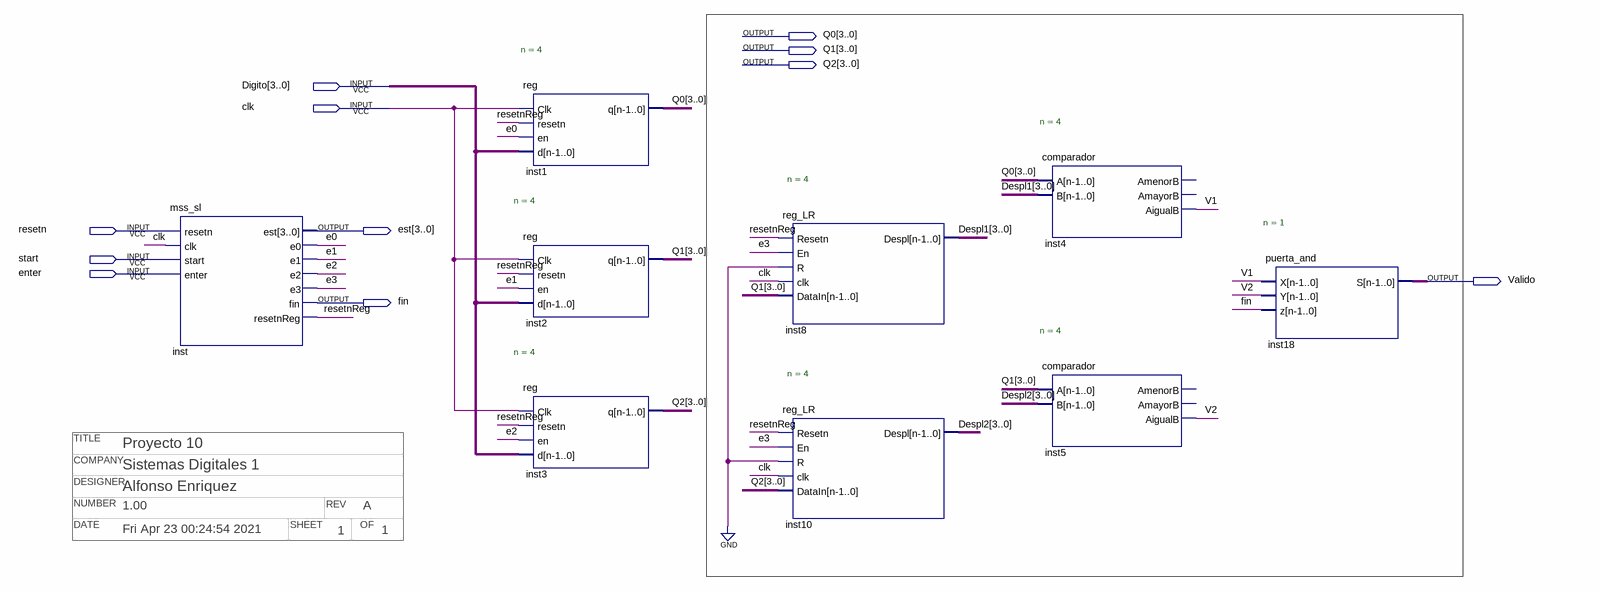
[diagram p0: schematic sheet]
// Quartus schematic Proyecto10.bdf as structural Verilog: 9 symbols, 11 pins
// Title block: COMPANY: Sistemas Digitales 1; DATE: Fri Apr 23 00:24:54 2021; DESIGNER: Alfonso Enriquez; NUMBER: 1.00; OF: 1; REV: A; SHEET: 1; TITLE: Proyecto 10
module Proyecto10 (
  input  [3:0] Digito,
  input  clk,
  input  resetn,
  input  start,
  input  enter,
  output [3:0] Q0,
  output [3:0] Q1,
  output [3:0] Q2,
  output [3:0] est,
  output Valido,
  output fin
);

  wire e0, e1, e2, e3, resetnReg, V1, V2;
  wire [3:0] Despl1, Despl2;

  mss_sl inst (
    .resetn(resetn), .clk(clk), .start(start), .enter(enter), .est(est), .e0(e0), .e1(e1), .e2(e2), .e3(e3),
    .fin(fin), .resetnReg(resetnReg));
  \reg  #(.n(4)) inst1 (.Clk(clk), .resetn(resetnReg), .en(e0), .d(Digito), .q(Q0));
  \reg  #(.n(4)) inst2 (.Clk(clk), .resetn(resetnReg), .en(e1), .d(Digito), .q(Q1));
  \reg  #(.n(4)) inst3 (.Clk(clk), .resetn(resetnReg), .en(e2), .d(Digito), .q(Q2));
  reg_LR #(.n(4)) inst8 (.Resetn(resetnReg), .En(e3), .R(1'b0), .clk(clk), .DataIn(Q1), .Despl(Despl1));
  reg_LR #(.n(4)) inst10 (.Resetn(resetnReg), .En(e3), .R(1'b0), .clk(clk), .DataIn(Q2), .Despl(Despl2));
  comparador #(.n(4)) inst4 (.A(Q0), .B(Despl1), .AigualB(V1));  // open: AmenorB, AmayorB
  comparador #(.n(4)) inst5 (.A(Q1), .B(Despl2), .AigualB(V2));  // open: AmenorB, AmayorB
  puerta_and #(.n(1)) inst18 (.X(V1), .Y(V2), .z(fin), .S(Valido));
endmodule
